# EAGLE design RoboBeacon-002 (EAGLE 5.11)
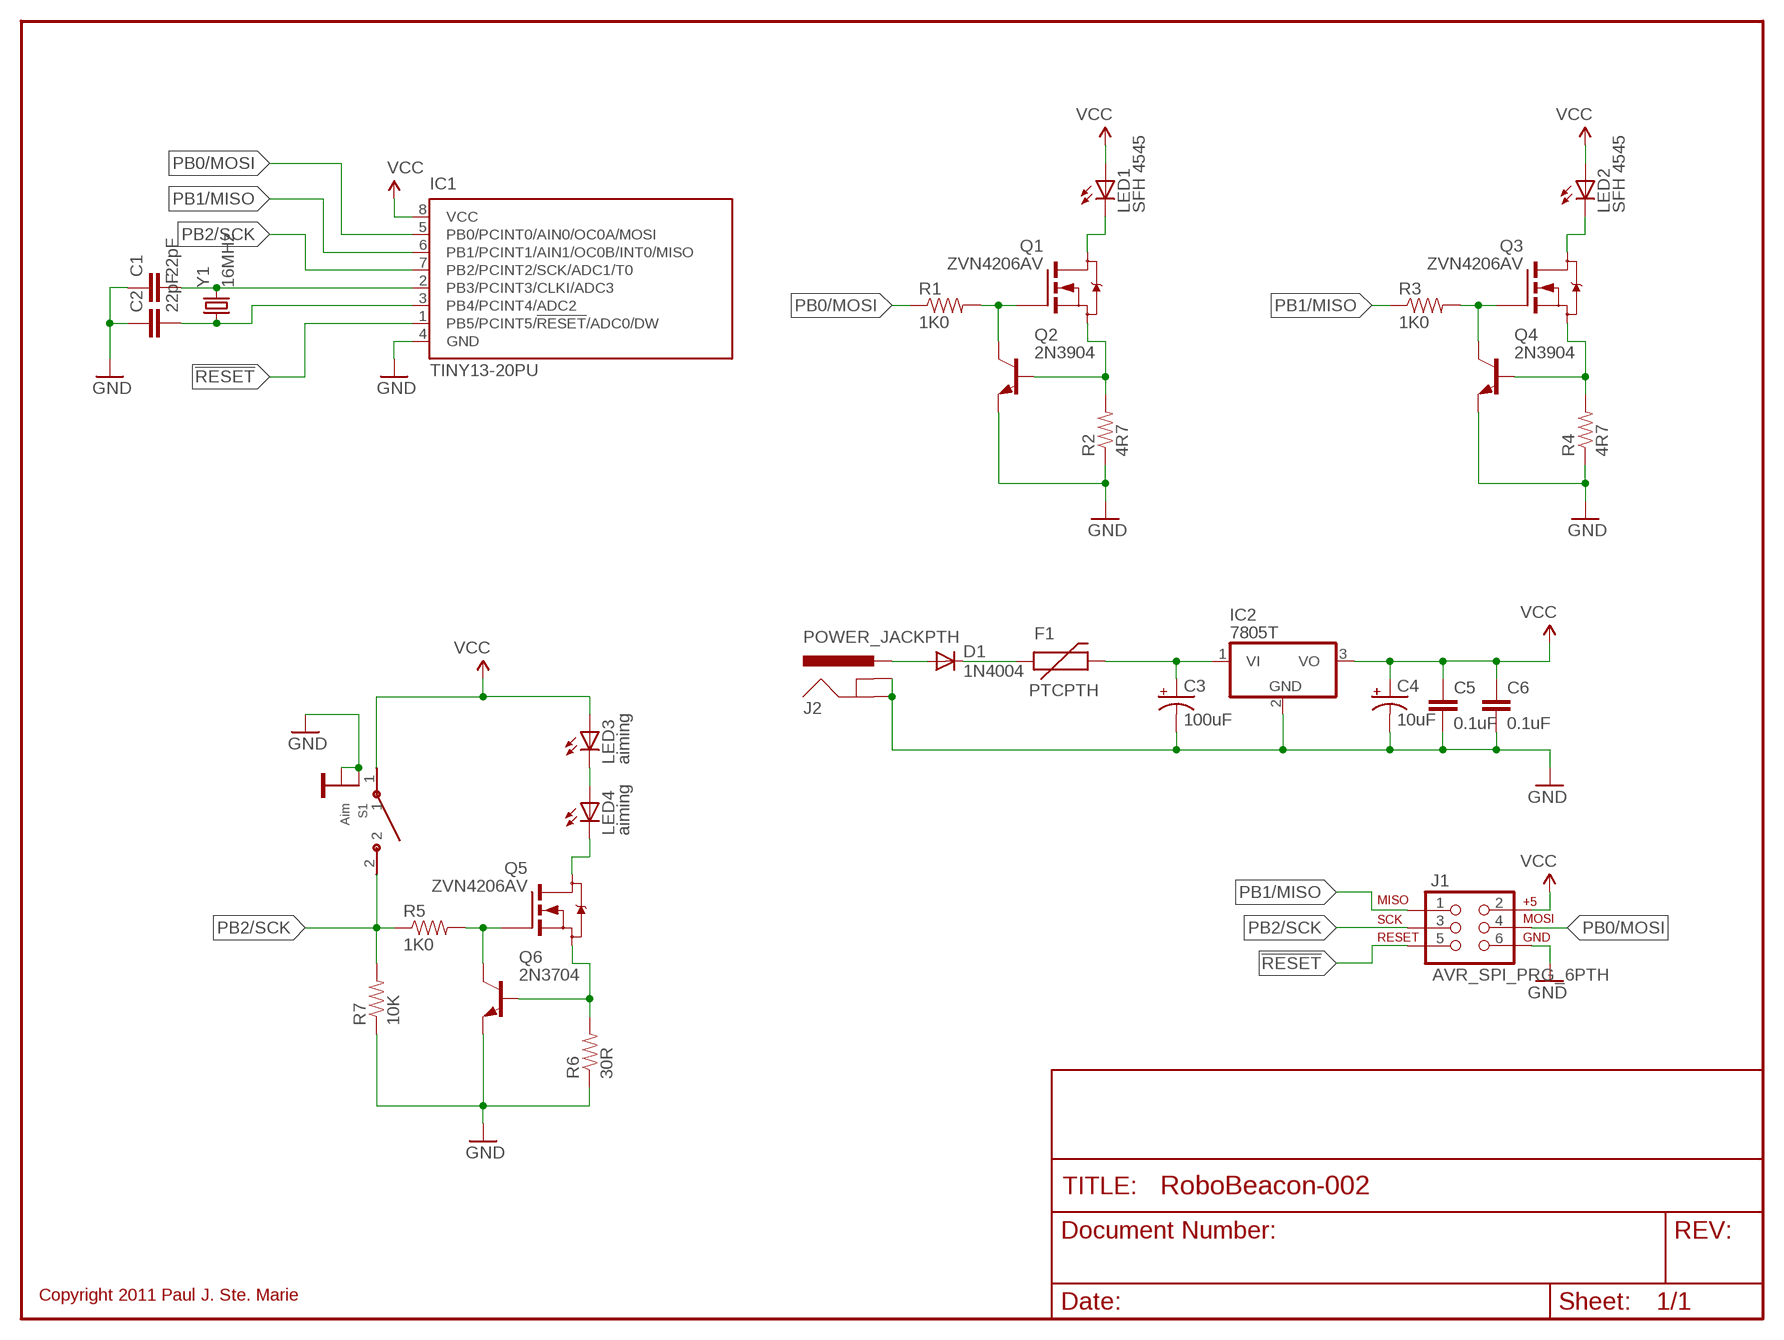
[diagram p0: schematic, sheet 1]

## Parts
C1  22pF  CAPPTH  [CAP-PTH-SMALL]
C2  22pF  CAPPTH  [CAP-PTH-SMALL]
C3  100uF  CAP_POLPTH1  [CPOL-RADIAL-100UF-25V]
C4  10uF  CAP_POLPTH2  [CPOL-RADIAL-10UF-25V]
C5  0.1uF  CAPPTH  [CAP-PTH-SMALL]
C6  0.1uF  CAPPTH  [CAP-PTH-SMALL]
D1  1N4004  [DO41-10]
F1  PTCPTH  [PTC]
IC1  TINY13-20PU  [DIL08]
IC2  7805T  [TO220H]
J1  AVR_SPI_PRG_6PTH  [2X3]
J2  POWER_JACKPTH  [POWER_JACK_PTH]
LED1  SFH 4545  LED5MM  [LED5MM]
LED2  SFH 4545  LED5MM  [LED5MM]
LED3  aiming  LED5MM  [LED5MM]
LED4  aiming  LED5MM  [LED5MM]
Q1  ZVN4206AV  N_MOSFET_DIODE-TO92L  [TO92L]
Q2  2N3904  NPN-TO92L  [TO92L]
Q3  ZVN4206AV  N_MOSFET_DIODE-TO92L  [TO92L]
Q4  2N3904  NPN-TO92L  [TO92L]
Q5  ZVN4206AV  N_MOSFET_DIODE-TO92L  [TO92L]
Q6  2N3704  NPN-TO92L  [TO92L]
R1  1K0  RESISTORAXIAL-0.3  [AXIAL-0.3]
R2  4R7  RESISTORAXIAL-0.3  [AXIAL-0.3]
R3  1K0  RESISTORAXIAL-0.3  [AXIAL-0.3]
R4  4R7  RESISTORAXIAL-0.3  [AXIAL-0.3]
R5  1K0  RESISTORAXIAL-0.3  [AXIAL-0.3]
R6  30R  RESISTORAXIAL-0.3  [AXIAL-0.3]
R7  10K  RESISTORAXIAL-0.3  [AXIAL-0.3]
S1  Aim  SWITCH-SPST-B3F-3120  [OMRON-B3F-RA6MM]
Y1  16MHz  CRYSTALHC49UV  [HC49U-V]

## Nets
!RESET: IC1.1(PB5/PCINT5/!RESET!/ADC0/DW) J1.5
GND: C1.1 C2.1 C3.2(-) C4.2(-) C5.2 C6.2 IC1.4(GND) IC2.2(GND) J1.6 J2.GND J2.GNDBREAK Q2.1(E) Q4.1(E) Q6.1(E) R2.P$1 R4.P$1 R6.P$1 R7.P$1 S1.G@1(GND) S1.G@2(GND)
N$1: Q1.2(G) Q2.3(C) R1.P$2
N$2: Q1.1(S) Q2.2(B) R2.P$2
N$3: LED3.K(C) LED4.A
N$4: LED1.K(C) Q1.3(D)
N$5: Q3.2(G) Q4.3(C) R3.P$2
N$6: Q3.1(S) Q4.2(B) R4.P$2
N$7: LED2.K(C) Q3.3(D)
N$8: Q5.2(G) Q6.3(C) R5.P$2
N$9: Q5.1(S) Q6.2(B) R6.P$2
N$10: LED4.K(C) Q5.3(D)
N$11: D1.C F1.P$1
N$12: D1.A J2.PWR
N$13: C3.1(+) F1.P$2 IC2.1(VI)
PB0/MOSI: IC1.5(PB0/PCINT0/AIN0/OC0A/MOSI) J1.4 R1.P$1
PB1/MISO: IC1.6(PB1/PCINT1/AIN1/OC0B/INT0/MISO) J1.1 R3.P$1
PB2/SCK: IC1.7(PB2/PCINT2/SCK/ADC1/T0) J1.3 R5.P$1 R7.P$2 S1.2
VCC: C4.1(+) C5.1 C6.1 IC1.8(VCC) IC2.3(VO) J1.2 LED1.A LED2.A LED3.A S1.1
XTAL1: C1.2 IC1.2(PB3/PCINT3/CLKI/ADC3) Y1.2
XTAL2: C2.2 IC1.3(PB4/PCINT4/ADC2) Y1.1

## Notes on the sheet
- Copyright 2011 Paul J. Ste. Marie

## Library data of the parts
C1 C2 C5 C6 = SparkFun:CAP: Capacitor Standard 0603 ceramic capacitor, and 0.1" leaded capacitor.
C3 C4 = SparkFun:CAP_POL: Capacitor Polarized These are standard SMD and PTH capacitors. Normally 10uF, 47uF, and 100uF in electrolytic and tantalum varieties. Always verify the external diameter of the through hole cap, it varies with capacity, voltage, and manufacturer. The EIA devices should be standard.
D1 = adafruit:1N4004: DIODE General purpose 1N400x type rectifier (With bigger pads) http://www.ladyada.net/library/pcb/eaglelibrary.html
F1 = SteMarie:PTC: Resettable Fuse PTC Resettable Fuse. Spark Fun Electronics SKU : COM-08357
IC1 = atmel:TINY13: 8-bit AVR Microcontroller with 1K Bytes In-System Programmable Flash Source: http://www.atmel.com/dyn/resources/prod_documents/2535S.pdf; MPN: ATTINY13-20PU; OC_FARNELL: 9171550; OC_NEWARK: 96K6521
IC2 = linear:78*: Positive VOLTAGE REGULATOR Source: http://cache.national.com/ds/LM/LM78L05.pdf http://www.fairchildsemi.com/ds/LM/LM7805.pdf
J1 = SteMarie:AVR_SPI_PRG_6: AVR ISP 6 Pin This is the reduced ISP connector for AVR programming. Common on Arduino. This footprint will take up less PCB space and can be used with a 10-pin to 6-pin adapter such as SKU: BOB-08508
J2 = SparkFun:POWER_JACK: Power Jack This is the standard 5.5mm barrel jack for power. The PTH is the most common, proven, reliable, footprint. All others are experimental. The Slot footprint only works if the mill layer is transmitted to the PCB fab house so be warned. Spark Fun Electronics SKU : PRT-00119. Mating wall wart : TOL-00298 (and others)
LED1-LED4 = adafruit:LED: LED OSRAM: - CHIPLED LG R971, LG N971, LY N971, LG Q971, LY Q971, LO R971, LY R971 LH N974, LH R974 LS Q976, LO Q976, LY Q976 LO Q996 - Hyper CHIPLED LW Q18S LB Q993, LB Q99A, LB R99A - SideLED LS A670, LO A670, LY A670, LG A670, LP A670 LB A673, LV A673, LT A673, LW A673 LH A674 LY A675 LS A676, LA A676, LO A676, LY A676, LW A676 LS A679, LY A679, LG A679 - Hyper Micro SIDELED® LS Y876, LA Y876, LO Y876, LY Y876 LT Y87S - SmartLED LW L88C, LW L88S LB L89C, LB L89S, LG L890 LS L89K, LO L89K, LY L89K LS L896, LA L896, LO L896, LY L896 - TOPLED LS T670, LO T670, LY T670, LG T670, LP T670 LSG T670, LSP T670, LSY T670, LOP T670, LYG T670 LG T671, LOG T671, LSG T671 LB T673, LV T673, LT T673, LW T673 LH T674 LS T676, LA T676, LO T676, LY T676, LB T676, LH T676, LSB T676, LW T676 LB T67C, LV T67C, LT T67C, LS T67K, LO T67K, LY T67K, LW E67C LS E67B, LA E67B, LO E67B, LY E67B, LB E67C, LV E67C, LT E67C LW T67C LS T679, LY T679, LG T679 LS T770, LO T770, LY T770, LG T770, LP T770 LB T773, LV T773, LT T773, LW T773 LH T774 LS E675, LA E675, LY E675, LS T675 LS T776, LA T776, LO T776, LY T776, LB T776 LHGB T686 LT T68C, LB T68C - Hyper Mini TOPLED® LB M676 - Mini TOPLED Santana® LG M470 LS M47K, LO M47K, LY M47K Source: http://www.osram.convergy.de/
Q1 Q3 Q5 = SteMarie-transistor:N_MOSFET_DIODE-
Q2 Q4 Q6 = SteMarie-transistor:NPN-: NPN Transistror
R1-R7 = SparkFun:RESISTOR: Resistor Basic schematic elements and footprints for 0603, 1206, and PTH resistors.
S1 = SteMarie:SWITCH-SPST-?*; ACTUATION_FORCE: 100 gf; ACTUATOR_STYLE: Standard; TYPE: NC
Y1 = SparkFun:CRYSTAL: Crystals Various standard crystals. Proven footprints. Spark Fun Electronics SKU : COM-00534

## Board
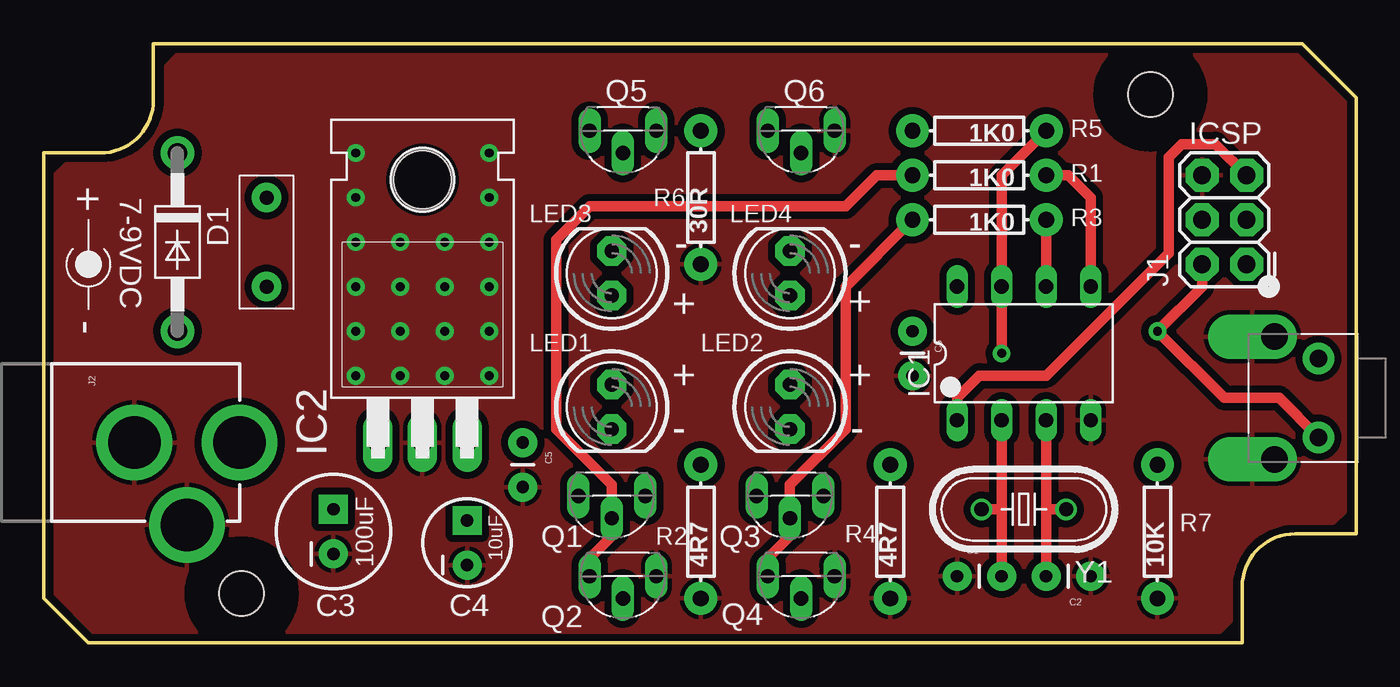
[diagram p1: board, top side]
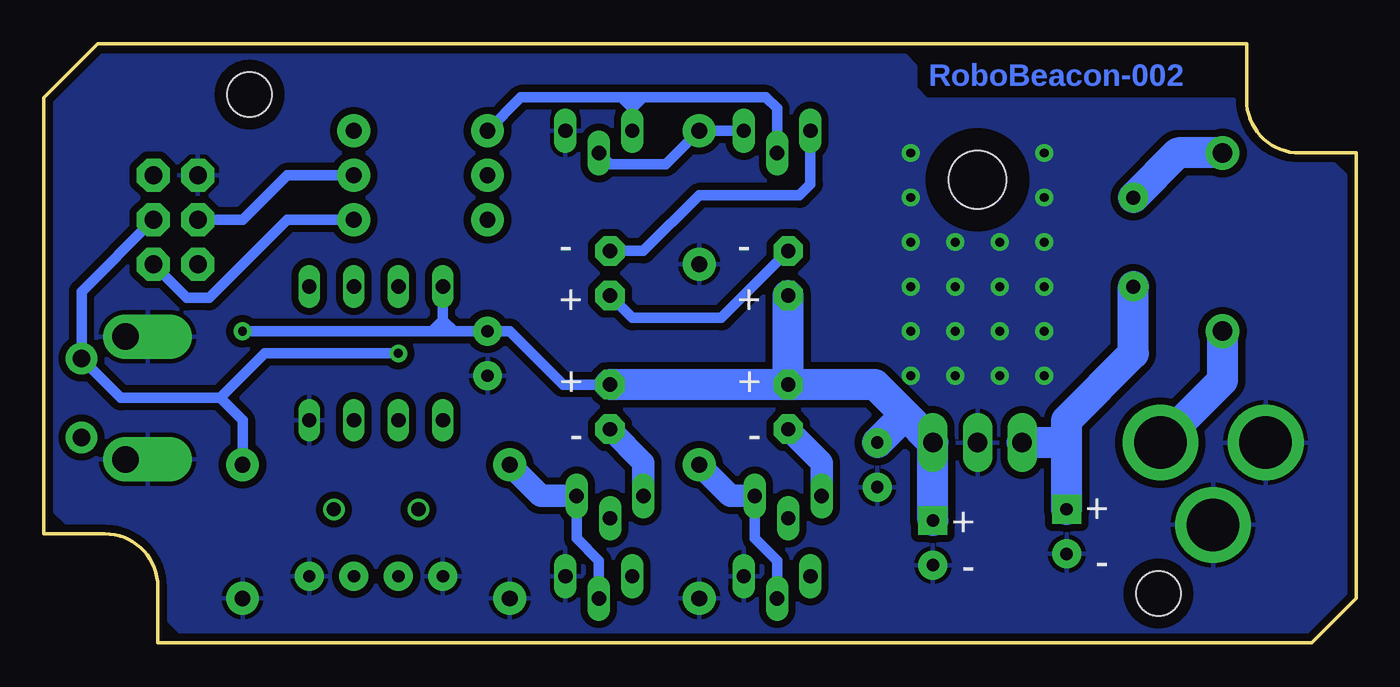
[diagram p2: board, bottom side, seen from below]

Size 74.83 x 34.16 mm. Coordinates in mm from the lower left corner, seen from the top.
Copper layers (1*16): Top 0.035mm / dielectric 1.5mm / Bottom 0.035mm
Design rules "SparkFun *": minimum track width 8mil, minimum drill 20mil, track to track 8mil, track to pad 8mil, pad to pad 8mil, via to via 8mil, smd to smd 8mil, copper to edge 10mil, drill to drill 8mil, minimum pad ring 8mil, minimum via ring 10mil, stop-mask expansion 4mil, vias tented up to drill 25mil, thermal gap 10mil

### Footprints (pad centres in the part's own frame; a part is rotated, then mirrored left to right if it is on the bottom)
CAP-PTH-SMALL = drill 0.7 pad 1.651 round: 1 0,0; 2 2.54,0
CPOL-RADIAL-100UF-25V = drill 0.7 pad 1.651 square: 1 1.27,0 | drill 0.7 pad 1.651 round: 2 -1.27,0
CPOL-RADIAL-10UF-25V = drill 0.7 pad 1.651 square: 1 1.27,0 | drill 0.7 pad 1.651 round: 2 -1.27,0
DO41-10 = drill 1.118 pad 1.93 round: A 5.08,0; C -5.08,0
PTC = drill 0.8 pad 1.676 round: P$1 -2.54,0; P$2 2.54,0
DIL08 = drill 0.813 long: 1 -3.81,-3.81; 2 -1.27,-3.81; 3 1.27,-3.81; 4 3.81,-3.81; 5 3.81,3.81; 6 1.27,3.81; 7 -1.27,3.81; 8 -3.81,3.81
TO220H = drill 1.118 long: 1 -2.54,-10.16; 2 0,-10.16; 3 2.54,-10.16 | hole 3.302: 0,4.826
2X3 = drill 1.016 pad 1.88 octagon: 1 -2.54,-1.27; 2 -2.54,1.27; 3 0,-1.27; 4 0,1.27; 5 2.54,-1.27; 6 2.54,1.27
POWER_JACK_PTH = drill 2.997 pad 4.318 round: GND 0,7.7; GNDBREAK 4.7,10.7; PWR 0,13.7
LED5MM = drill 0.813 pad 1.676 octagon: A -1.27,0; K 1.27,0
TO92L = drill 0.813 pad 1.27 long: 1 -1.905,0; 2 0,1.27; 3 1.905,0
AXIAL-0.3 = drill 0.9 pad 1.88 round: P$1 -3.81,0; P$2 3.81,0
OMRON-B3F-RA6MM = drill 1 pad 1.778 round: 1 -2.25,2.25; 2 2.25,2.25 | drill 1.5 pad 2.54 offset: G@1 -3.5,4.75; G@2 3.5,4.75
FLX-1632 = hole 2.54: 11.278,2.819; 63.094,31.267
HC49U-V = drill 0.813 round: 1 -2.413,0; 2 2.413,0

### Placement (x,y rotation side)
C1  52.07,3.81 0 top
C2  59.69,3.81 180 top
C3  16.51,6.35 90 top
C4  24.13,5.71 90 top
C5  27.3,11.43 270 top
C6  49.53,17.78 270 top
D1  7.62,22.86 270 top
F1  12.7,22.86 270 top
IC1  55.88,16.51 0 top
IC2  21.59,21.59 0 top
J1  67.31,24.13 90 top
J2  -2.54,11.43 270 top
LED1  32.38,13.46 270 top
LED2  42.55,13.46 270 top
LED3  32.38,21.08 90 top
LED4  42.55,21.08 90 top
Q1  32.38,8.38 180 top
Q2  33.02,3.81 180 top
Q3  42.55,8.38 180 top
Q4  43.18,3.81 180 top
Q5  33.02,29.21 180 top
Q6  43.18,29.21 180 top
R1  53.34,26.67 180 top
R2  37.47,6.35 90 top
R3  53.34,24.13 180 top
R4  48.26,6.35 90 top
R5  53.34,29.21 180 top
R6  37.47,25.4 90 top
R7  63.5,6.35 90 top
S1  74.93,13.97 90 top
U$1  7-9VDC  [CENTER+JACK_LABEL]  2.54,21.59 270 top
U$2  [FLX-1632]  0,0 0 top
Y1  55.88,7.62 180 top

### Tracks (layer width: path | path; a pad name or v marks a point on that pad's centre or on a via)
!RESET
  Top 0.61: IC1.1 52.07,13.97 53.34,15.24 57.15,15.24 64.14,22.23 64.14,27.69 64.9,28.45 66.8,28.45 J1.5
GND  (via drill 0.51)
  other vias: 17.78,27.94 20.32,20.32 20.32,22.86 22.86,22.86 22.86,20.32 20.32,17.78 22.86,17.78 25.4,20.32 25.4,17.78 25.4,15.24 22.86,15.24 25.4,22.86 25.4,25.4 25.4,27.94 17.78,25.4 17.78,22.86 17.78,20.32 17.78,17.78 20.32,15.24 17.78,15.24
  pour Top (isolate 0.406): 67.69,3.2 arc-90 71.35,6.86 73.53,6.86 74.17,7.49 74.17,30.86 71.5,33.53 7.62,33.53 6.99,32.89 6.99,30.99 arc-90 3.3,27.3 1.27,27.3 0.64,26.67 0.64,2.67 2.67,0.64 67.06,0.64 67.69,1.27
  pour Bottom (isolate 0.406): 67.69,3.2 arc-90 71.35,6.86 73.53,6.86 74.17,7.49 74.17,30.86 71.5,33.53 25.78,33.53 25.15,32.89 25.15,31.62 24.51,30.99 6.99,30.99 arc-90 3.3,27.3 1.27,27.3 0.64,26.67 0.64,2.67 2.67,0.64 67.06,0.64 67.69,1.27
N$1
  Top 0.61: Q2.3 31.11,4.83 32.38,6.1 Q1.2 32.38,9.02 29.21,12.19 29.21,22.99 31.11,24.89 45.72,24.89 47.5,26.67 R1.P$2
N$2
  Bottom 0.61: Q2.2 33.02,4.7 34.29,5.97 Q1.1
  Bottom 1.27: Q1.1 35.69,8.38 R2.P$2
N$3
  Bottom 0.61: LED3.K 36.2,18.54 41.27,18.54 LED4.A
N$4
  Bottom 1.27: Q1.3 30.48,10.29 LED1.K
N$5
  Top 0.61: Q4.3 41.27,4.83 42.55,6.1 Q3.2 42.55,9.02 45.72,12.19 45.72,20.32 R3.P$2
N$6
  Bottom 0.61: Q4.2 43.18,4.7 44.45,5.97 Q3.1
  Bottom 1.27: Q3.1 46.48,8.38 R4.P$2
N$7
  Bottom 1.27: LED2.K 40.64,10.29 Q3.3
N$8
  Bottom 0.61: 41.27,30.48 41.91,31.11 | 41.91,31.11 47.62,31.11 R5.P$2 | 41.27,30.48 Q6.3 | 40.64,31.11 41.27,30.48 | 40.64,31.11 33.66,31.11 33.02,30.48 Q5.2 | 40.64,31.11 41.91,31.11
N$9
  Bottom 0.61: Q5.1 R6.P$2 39.37,27.3 42.55,27.3 Q6.2
N$10
  Bottom 0.61: LED4.K 40.64,22.35 37.47,25.53 31.75,25.53 31.11,26.16 Q5.3
N$11
  Bottom 1.778: D1.C 10.16,27.94 F1.P$1
N$12
  Bottom 1.778: J2.PWR 7.62,14.97 D1.A
N$13
  Bottom 1.778: 16.51,11.43 IC2.1 | F1.P$2 12.7,16.51 16.51,12.7 16.51,11.43 | C3.1 16.51,11.43
PB0/MOSI
  Top 0.61: IC1.5 59.69,25.4 58.42,26.67 R1.P$1
  Bottom 0.61: R1.P$1 60.96,26.67 63.5,24.13 J1.4
PB1/MISO
  Top 0.61: IC1.6 R3.P$1
  Bottom 0.61: R3.P$1 60.96,24.13 65.41,19.68 66.67,19.68 J1.1
PB2/SCK  (via drill 0.51)
  Top 0.61: R5.P$1 54.61,26.67 IC1.7 v54.61,16.51
  Bottom 0.61: v54.61,16.51 62.23,16.51 64.77,13.97 | 64.77,13.97 63.5,12.7 R7.P$2 | J1.3 72.68,20.03 S1.2 70.43,13.97 64.77,13.97
VCC  (via drill 0.51)
  Top 0.61: S1.1 70.43,13.97 67.31,13.97 v63.5,17.78 66.04,20.32 J1.2
  Bottom 0.61: LED2.A 45.21,14.73 48.26,17.78 C6.1 51.44,17.78 | 51.44,17.78 52.07,17.78 | 52.07,17.78 52.07,18.41 | 52.07,18.41 IC1.8 | 52.07,17.78 52.7,17.78 | 52.7,17.78 v63.5,17.78 | 51.44,17.78 52.07,18.41 | 52.07,18.41 52.7,17.78
  Bottom 1.778: LED1.A LED3.A | LED1.A LED2.A | C4.1 IC2.3 25.72,13.02 | LED1.A 27.43,14.73 25.72,13.02 | 25.72,13.02 C5.1
XTAL1
  Top 0.61: C1.2 54.61,7.62 | 54.61,7.62 IC1.2 | 54.61,7.62 Y1.2
XTAL2
  Top 0.61: C2.2 57.15,7.62 | 57.15,7.62 IC1.3 | 57.15,7.62 Y1.1

### Text on the board
Bottom: RoboBeacon-002
tPlace: ICSP | - | - | + | + | + | + | - | -
bPlace: - | - | + | + | + | + | - | - | + | + | - | -
tDocu: Copyright 2011 Paul J. Ste. Marie